# Altium schematic sheet power.SchDoc
size A4; SheetNumber: 5; SheetTotal: 5
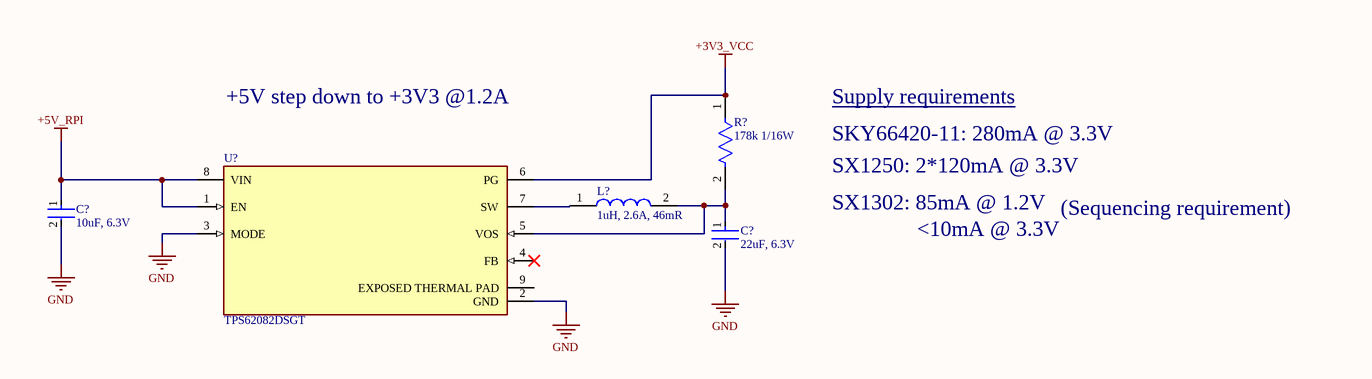
[diagram p0: power.SchDoc]

## Parts
(Parts that share a designator on the sheet are numbered #1, #2 ... from top to bottom, then left to right.)
C?#1  10uF, 6.3V  [FP-CL10-IPC_A]
C?#2  22uF, 6.3V  [FP-GRM21B-0_15-IPC_B]
L?  1uH, 2.6A, 46mR  [XFL3012102MEC]
R?  178k 1/16W  [FP-RN731J-MFG]
U?  TPS62082DSGT  [FP-DSG0008A-IPC_C]

## Nets
+3V3_VCC: R?.1 U?.6(PG)
+5V_RPI: C?#1.1 U?.1(EN) U?.8(VIN)
GND: C?#1.2 C?#2.2 U?.2(GND) U?.3(MODE)
NetC?#2_1: C?#2.1 L?.2 R?.2 U?.5(VOS)
NetL?_1: L?.1 U?.7(SW)

Not connected (* = marked no-connect by the designer): U? 4(FB)* 9(EXPOSED_THERMAL_PAD)

## Notes on the sheet
- +5V step down to +3V3 @1.2A
- Supply requirements
- SKY66420-11: 280mA @ 3.3V
- SX1250: 2*120mA @ 3.3V
- SX1302: 85mA @ 1.2V
- <10mA @ 3.3V
- (Sequencing requirement)

## Library data of the parts
C?#1 = CMP-13271-001938-1: Cap Ceramic 10uF 6.3V X5R ±20% Pad SMD 0603 +85°C T/R; Contact Plating: Tin; Height: 0.8mm; Width: 0.031inch; Min Operating Temperature: -55°C; Capacitance: 10uF; Dielectric: X5R; Voltage Rating: 6.3V; Case/Package: 0603; Package Quantity: 1; Radiation Hardening: No; Packaging: Tape and Reel; Max Operating Temperature: 85°C; Voltage: 6.3V; Thickness: 0.035inch; Mount: Surface Mount; Case Code (Imperial): 0603; Case Code (Metric): 1608; Depth: 0.8mm; Tolerance: 20%; Length: 1.6mm
C?#2 = CMP-2007-03385-2: Chip Multilayer Ceramic Capacitors for General Purpose, 0805, 22uF, X5R, 15%, 20%, 6.3V; Material: Ceramic; Max Operating Temperature: 85°C; Voltage: 6.3V; Min Operating Temperature: -55°C; Case/Package: 0805; Thickness: 0.053inch; Dielectric: X5R; Packaging: Tape and Reel; Depth: 1.25mm; Termination: SMD/SMT; Voltage Rating (DC): 6.3V; Radiation Hardening: No; Tolerance: 20%; Mount: Surface Mount; Lead Free: Lead Free; Package Quantity: 1; REACH SVHC: No SVHC; Voltage Rating: 6.3V; Capacitance: 22uF; Length: 2mm; Case Code (Imperial): 0805; Case Code (Metric): 2012; Width: 0.049inch; Height: 1.25mm
L? = XFL3012-102MEC: Inductor; Manufacturer_Name: COILCRAFT; Datasheet Link: https://www.coilcraft.com/getmedia/f76a3c9b-4fff-4397-8028-ef8e043eb200/xfl3012.pdf; Height: 1.3mm; Manufacturer_Part_Number: XFL3012-102MEC; Mouser Part Number: 994-XFL3012-102MEC; Mouser Price/Stock: https://www.mouser.co.uk/ProductDetail/Coilcraft/XFL3012-102MEC?qs=zCSbvcPd3pbDTGh%2Fo89qrw%3D%3D
R? = CMP-03211-009852-1: Thin Film Resistors RN 0603 178KΩ 0.1% 10ppm/°C; Manufacturer: TE Connectivity; Manufacturer Part Number: RN73C1J178KBTDF; Voltage Rating: 50V; Power Rating: 0.063W; Device Class L3: Chip SMD Resistors; octopart_url: https://octopart.com/rn73c1j178kbtdf-te+connectivity-22738583; Ipc Land Pattern Name: RESC15580X45; Device Class L1: Passive Components; Height: 0.55mm; Octopart: https://octopart.com/rn73c1j178kbtdf-te+connectivity-22738583; Automotive: No; Temperature Range Low: -55°C; Temperature: -55°C to +155°C; Value: 178KΩ; Composition: Thin Film; Temperature Range High: +155°C; Device Class L2: Resistors; ComponentLink2Description: Datasheet; Series: RN73; packaging: 1000 Reel; Resistance: 178KΩ; Tolerance: 0.1%; Category: Res; Package: RN731J; Lead Free: Yes; RoHS: TRUE; Temperature Coefficient: 10ppm/°C; ComponentLink2URL: https://www.te.com/commerce/DocumentDelivery/DDEController?Action=showdoc&DocId=Data+Sheet%7F1773270%7FP%7Fpdf%7FEnglish%7FENG_DS_1773270_P.pdf%7F9-1614352-9
U? = CMP-0323-00342-4: IC REG BUCK 3.3V 1.2A 8WSON; Max Input Voltage: 6V; Min Input Voltage: 2.3V; Output Type: Fixed; Switching Frequency: 2MHz; Quiescent Current: 6uA; Number of Outputs: 1; Synchronous Rectifier: Yes; Contact Plating: Gold; Packaging: Tape and Reel; Radiation Hardening: No; Package Quantity: 1; Length: 2.1mm; Height: 0.75mm; Max Output Current: 1.2A; Number of Pins: 8; Output Current: 1.2A; Lead Free: Lead Free; Min Operating Temperature: -40°C; Max Operating Temperature: 125°C; REACH SVHC: No SVHC; Output Voltage: 3.3V; Min Output Voltage: 3.3V; Width: 2.1mm; Nominal Output Voltage: 3.3V; Max Output Voltage: 3.3V; Operating Supply Voltage: 6V